# Altium project SAM_E54_Xplained_Pro.PrjPCB (part 4 of 4)
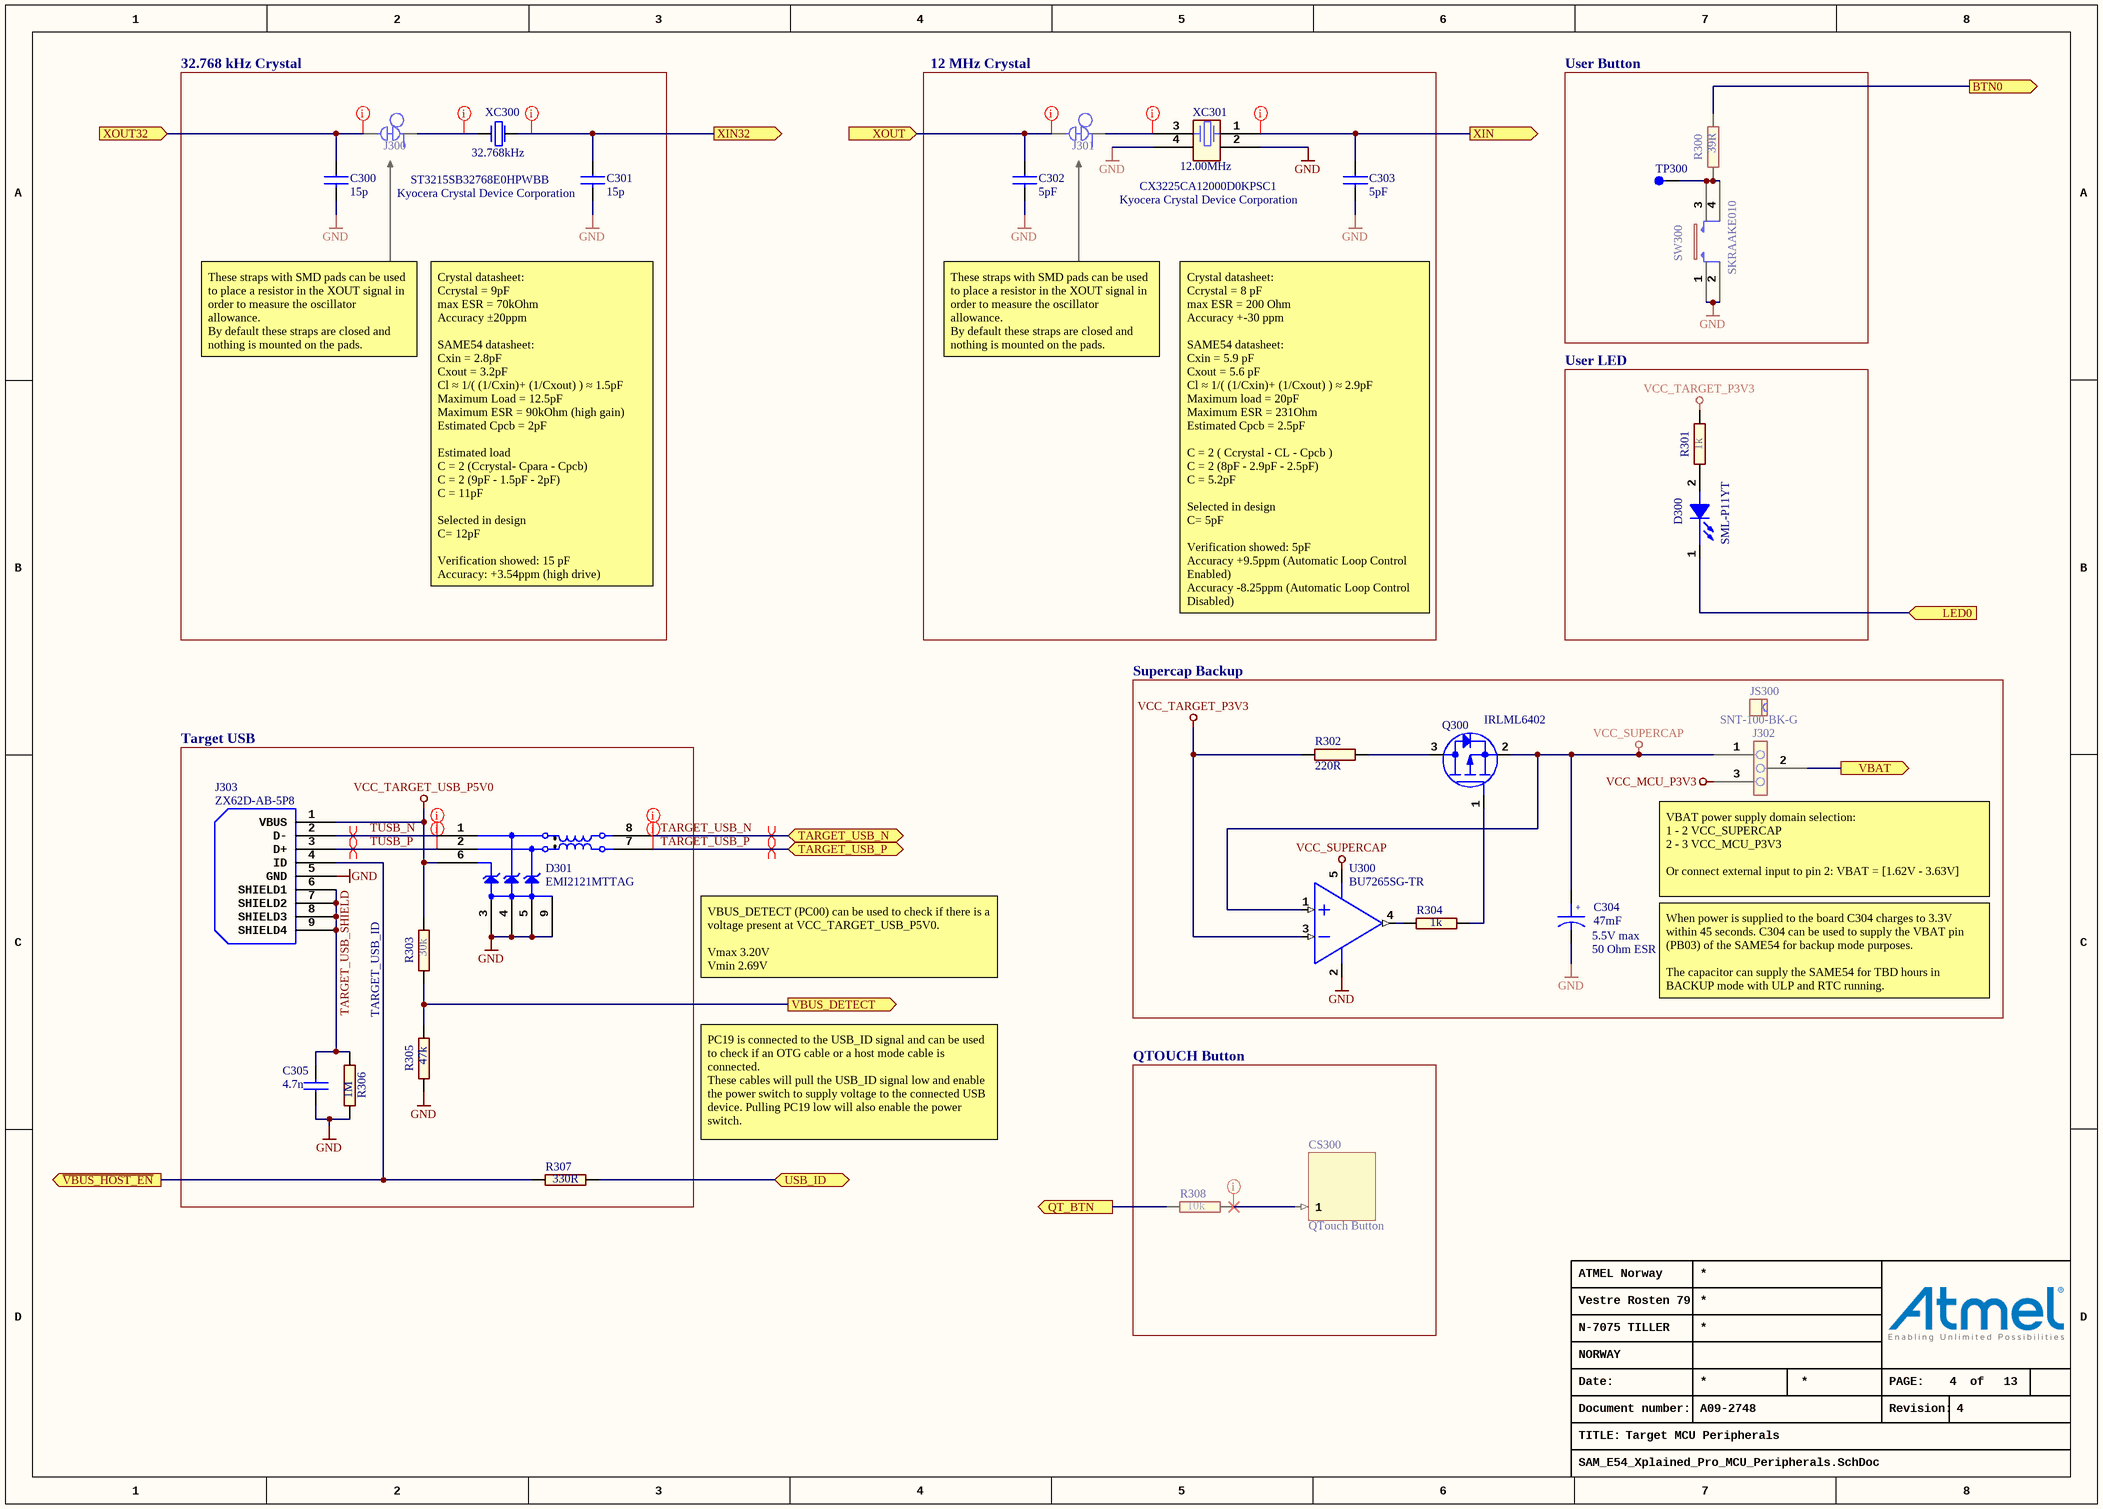
[diagram p13: SAM_E54_Xplained_Pro_MCU_Peripherals.SchDoc]

## Nets that join several sheets
GND: SAM_E54_Xplained_Pro_Target_MCU (33 pins), SAM_E54_Xplained_Pro_EDBG (36 pins), SAM_E54_Xplained_Pro_Connectors (19 pins), SAM_E54_Xplained_Pro_triple_input_power_supply_HSW (21 pins), SAM_E54_Xplained_Pro_current_measurement (Q901.2 R900.1 R901.1), SAM_E54_Xplained_Pro_current_measurement_calibration (R1003.1 R1004.1 R1005.1 R1006.1), SAM_E54_Xplained_Pro_current_measurement_control (12 pins), SAM_E54_Xplained_Pro_current_measurement_frontend (12 pins), SAM_E54_Xplained_Pro_Ethernet (20 pins), SAM_E54_Xplained_Pro_CAN (6 pins), SAM_E54_Xplained_Pro_Memory (20 pins), SAM_E54_Xplained_Pro_MCU_Peripherals (18 pins)
VCC_CM_P3V3: SAM_E54_Xplained_Pro_triple_input_power_supply_HSW (R101.1), SAM_E54_Xplained_Pro_current_measurement (R902.2), SAM_E54_Xplained_Pro_current_measurement_calibration (R1000.2 R1001.2 R1002.2), SAM_E54_Xplained_Pro_current_measurement_control (6 pins), SAM_E54_Xplained_Pro_current_measurement_frontend (L1200.1)
VCC_EDBG_P3V3: SAM_E54_Xplained_Pro_EDBG (23 pins), SAM_E54_Xplained_Pro_triple_input_power_supply_HSW (R103.1)
VCC_EDBG_USB_P5V0: SAM_E54_Xplained_Pro_EDBG (C803.1 L800.2 U800.A10), SAM_E54_Xplained_Pro_triple_input_power_supply_HSW (Q101.1 R106.2)
VCC_EXT_P5V0: SAM_E54_Xplained_Pro_Connectors (J400.1), SAM_E54_Xplained_Pro_triple_input_power_supply_HSW (5 pins)
VCC_MCU_P3V3: SAM_E54_Xplained_Pro_Target_MCU (19 pins), SAM_E54_Xplained_Pro_triple_input_power_supply_HSW (J103.1), SAM_E54_Xplained_Pro_MCU_Peripherals (J302.3)
VCC_P5V0: SAM_E54_Xplained_Pro_Connectors (J400.3), SAM_E54_Xplained_Pro_triple_input_power_supply_HSW (12 pins), SAM_E54_Xplained_Pro_current_measurement_control (R1104.2), SAM_E54_Xplained_Pro_current_measurement_frontend (L1201.1), SAM_E54_Xplained_Pro_CAN (C501.1 C502.1 U500.3)
VCC_TARGET_P3V3: SAM_E54_Xplained_Pro_Target_MCU (9 pins), SAM_E54_Xplained_Pro_Connectors (7 pins), SAM_E54_Xplained_Pro_triple_input_power_supply_HSW (J100.2 R110.2), SAM_E54_Xplained_Pro_Ethernet (12 pins), SAM_E54_Xplained_Pro_CAN (C503.1 U500.5), SAM_E54_Xplained_Pro_Memory (19 pins), SAM_E54_Xplained_Pro_MCU_Peripherals (R301.2 R302.1 U300.3)
VCC_TARGET_USB_P5V0: SAM_E54_Xplained_Pro_triple_input_power_supply_HSW (Q102.1 Q103.1 R107.2), SAM_E54_Xplained_Pro_MCU_Peripherals (D301.6 J303.1 R303.2)
CM_PA00_GPIO: SAM_E54_Xplained_Pro_current_measurement_calibration (Q1001.1 R1001.1), SAM_E54_Xplained_Pro_current_measurement_control (U1100.1)
CM_PA01_GPIO: SAM_E54_Xplained_Pro_current_measurement_calibration (Q1000.1 R1002.1), SAM_E54_Xplained_Pro_current_measurement_control (U1100.2)
CM_PA05_AIN5: SAM_E54_Xplained_Pro_current_measurement_control (U1100.5 U1100.6), SAM_E54_Xplained_Pro_current_measurement_frontend (C1206.2 R1208.2 U1200.7)
CM_PA08_AIN16: SAM_E54_Xplained_Pro_current_measurement_control (U1100.11), SAM_E54_Xplained_Pro_current_measurement_frontend (C1202.2 R1203.2 U1200.1)
CM_PA09_AIN17: SAM_E54_Xplained_Pro_EDBG (U800.K10), SAM_E54_Xplained_Pro_triple_input_power_supply_HSW (R111.1 R112.2), SAM_E54_Xplained_Pro_current_measurement_control (U1100.12)
CM_PA10_GPIO: SAM_E54_Xplained_Pro_current_measurement (Q900.1 Q901.1 R901.2), SAM_E54_Xplained_Pro_current_measurement_control (U1100.13)
CM_PA11_GCLK5: SAM_E54_Xplained_Pro_EDBG (U800.J3), SAM_E54_Xplained_Pro_current_measurement_control (U1100.14)
CM_PA14_GCLK0: SAM_E54_Xplained_Pro_EDBG (U800.C1), SAM_E54_Xplained_Pro_current_measurement_control (U1100.15)
CM_PA15_GPIO: SAM_E54_Xplained_Pro_current_measurement_calibration (Q1002.1 R1000.1), SAM_E54_Xplained_Pro_current_measurement_control (U1100.16)
CM_PA16_SERCOM1_SDA: SAM_E54_Xplained_Pro_EDBG (U800.J7), SAM_E54_Xplained_Pro_current_measurement_control (R1102.1 U1100.17)
CM_PA17_SERCOM1_SCL: SAM_E54_Xplained_Pro_EDBG (U800.K7), SAM_E54_Xplained_Pro_current_measurement_control (R1103.1 U1100.18)
CM_PA18_CMP0: SAM_E54_Xplained_Pro_current_measurement_control (U1100.19), SAM_E54_Xplained_Pro_current_measurement_frontend (Q1200.1 R1201.2)
CM_PA22_SERCOM3_PAD0_SPI_MOSI: SAM_E54_Xplained_Pro_EDBG (U800.C2), SAM_E54_Xplained_Pro_current_measurement_control (U1100.21)
CM_PA23_SERCOM3_PAD1_SPI_SCK: SAM_E54_Xplained_Pro_EDBG (U800.C4), SAM_E54_Xplained_Pro_current_measurement_control (U1100.22)
CM_PA24_SERCOM3_PAD2_SPI_MISO: SAM_E54_Xplained_Pro_EDBG (U800.B1), SAM_E54_Xplained_Pro_current_measurement_control (U1100.23)
CM_PA25_SPI_SS: SAM_E54_Xplained_Pro_EDBG (U800.D1), SAM_E54_Xplained_Pro_current_measurement_control (U1100.24)
CM_PA30_SWCLK: SAM_E54_Xplained_Pro_EDBG (U800.F4), SAM_E54_Xplained_Pro_current_measurement_control (U1100.31)
CM_PA31_SWDIO: SAM_E54_Xplained_Pro_EDBG (U800.E3), SAM_E54_Xplained_Pro_current_measurement_control (U1100.32)
CM_RESET_N: SAM_E54_Xplained_Pro_EDBG (U800.F3), SAM_E54_Xplained_Pro_current_measurement_control (U1100.26)
ID1: SAM_E54_Xplained_Pro_EDBG (R800.1 U800.A1), SAM_E54_Xplained_Pro_Connectors (J401.1)
ID2: SAM_E54_Xplained_Pro_EDBG (R801.1 U800.B2), SAM_E54_Xplained_Pro_Connectors (J402.1)
ID3: SAM_E54_Xplained_Pro_EDBG (R823.1 U800.B3), SAM_E54_Xplained_Pro_Connectors (J403.1)
NetJ100_3: SAM_E54_Xplained_Pro_triple_input_power_supply_HSW (J100.3 J102.3), SAM_E54_Xplained_Pro_current_measurement (Q900.3)
NetJ303_4: SAM_E54_Xplained_Pro_triple_input_power_supply_HSW (Q104.5 R110.1), SAM_E54_Xplained_Pro_MCU_Peripherals (J303.4 R307.1)
NetJ406_9: SAM_E54_Xplained_Pro_Target_MCU (R208.2), SAM_E54_Xplained_Pro_Connectors (J406.9)
NetJ406_10: SAM_E54_Xplained_Pro_Target_MCU (R207.2), SAM_E54_Xplained_Pro_Connectors (J406.10)
NetJ406_11: SAM_E54_Xplained_Pro_Target_MCU (R206.2), SAM_E54_Xplained_Pro_Connectors (J406.11)
NetJ406_12: SAM_E54_Xplained_Pro_Target_MCU (R205.2), SAM_E54_Xplained_Pro_Connectors (J406.12)
NetQ900_2: SAM_E54_Xplained_Pro_current_measurement (Q900.2 Q902.2 R900.2), SAM_E54_Xplained_Pro_current_measurement_frontend (Q1200.3 R1202.2 U1201.2)
NetQ902_3: SAM_E54_Xplained_Pro_current_measurement (Q902.3), SAM_E54_Xplained_Pro_current_measurement_calibration (Q1000.2 Q1001.2 Q1002.2 R1006.2)
PA00_XIN32: SAM_E54_Xplained_Pro_Target_MCU (U200.1), SAM_E54_Xplained_Pro_MCU_Peripherals (C301.1 XC300.1)
PA01_XOUT32: SAM_E54_Xplained_Pro_Target_MCU (U200.2), SAM_E54_Xplained_Pro_MCU_Peripherals (C300.1 J300.2)
PA02_ADC0_AIN0_DAC0: SAM_E54_Xplained_Pro_Target_MCU (U200.9), SAM_E54_Xplained_Pro_Connectors (J408.1)
PA03_ADC0_AIN1: SAM_E54_Xplained_Pro_Target_MCU (U200.10), SAM_E54_Xplained_Pro_Connectors (J402.4)
PA04_S0P0_UART_TX: SAM_E54_Xplained_Pro_Target_MCU (U200.21), SAM_E54_Xplained_Pro_Connectors (J401.14)
PA05_S0P1_UART_RX: SAM_E54_Xplained_Pro_Target_MCU (U200.22), SAM_E54_Xplained_Pro_Connectors (J401.13)
PA06_GPIO_S0P2_RTS: SAM_E54_Xplained_Pro_Target_MCU (U200.23), SAM_E54_Xplained_Pro_Connectors (J401.5)
PA07_GPIO_S0P3_CTS: SAM_E54_Xplained_Pro_Target_MCU (U200.24), SAM_E54_Xplained_Pro_Connectors (J401.6)
PA08_QSPI_DATA0: SAM_E54_Xplained_Pro_Target_MCU (U200.33), SAM_E54_Xplained_Pro_Memory (R713.2)
PA09_QSPI_DATA1: SAM_E54_Xplained_Pro_Target_MCU (U200.34), SAM_E54_Xplained_Pro_Memory (R714.2)
PA10_QSPI_DATA2: SAM_E54_Xplained_Pro_Target_MCU (U200.35), SAM_E54_Xplained_Pro_Memory (R715.2)
PA11_QSPI_DATA3: SAM_E54_Xplained_Pro_Target_MCU (U200.36), SAM_E54_Xplained_Pro_Memory (R716.2)
PA12_ETH_GRX1: SAM_E54_Xplained_Pro_Target_MCU (U200.60), SAM_E54_Xplained_Pro_Connectors (J406.5), SAM_E54_Xplained_Pro_Ethernet (R625.2)
PA13_ETH_GRX0: SAM_E54_Xplained_Pro_Target_MCU (U200.61), SAM_E54_Xplained_Pro_Connectors (J406.6), SAM_E54_Xplained_Pro_Ethernet (R624.2)
PA14_ETH_GTXCK: SAM_E54_Xplained_Pro_Target_MCU (U200.62), SAM_E54_Xplained_Pro_Connectors (J406.7), SAM_E54_Xplained_Pro_Ethernet (R630.2)
PA15_ETH_GRXER: SAM_E54_Xplained_Pro_Target_MCU (U200.63), SAM_E54_Xplained_Pro_Connectors (J406.8), SAM_E54_Xplained_Pro_Ethernet (R626.2)
PA16_PCC_D00_PTCXY10: SAM_E54_Xplained_Pro_Target_MCU (U200.66), SAM_E54_Xplained_Pro_Connectors (J406.16), SAM_E54_Xplained_Pro_MCU_Peripherals (R308.2)
PA17_ETH_GTXEN: SAM_E54_Xplained_Pro_Target_MCU (U200.67), SAM_E54_Xplained_Pro_Connectors (J406.15), SAM_E54_Xplained_Pro_Ethernet (R621.2)
PA18_ETH_GTX0: SAM_E54_Xplained_Pro_Target_MCU (U200.68), SAM_E54_Xplained_Pro_Connectors (J406.14), SAM_E54_Xplained_Pro_Ethernet (R622.2)
PA19_ETH_GTX1: SAM_E54_Xplained_Pro_Target_MCU (U200.69), SAM_E54_Xplained_Pro_Connectors (J406.13), SAM_E54_Xplained_Pro_Ethernet (R623.2)
PA20_SDHC_CMD: SAM_E54_Xplained_Pro_Target_MCU (R205.1 U200.88), SAM_E54_Xplained_Pro_Memory (J700.2 R705.1)
PA21_SDHC_CK: SAM_E54_Xplained_Pro_Target_MCU (R206.1 U200.89), SAM_E54_Xplained_Pro_Memory (J700.5)
PA22_S3P0_I2C_SDA: SAM_E54_Xplained_Pro_Target_MCU (R207.1 R220.1 U200.92), SAM_E54_Xplained_Pro_Connectors (J401.11)
PA23_S3P1_I2C_SCL: SAM_E54_Xplained_Pro_Target_MCU (R208.1 R221.1 U200.93), SAM_E54_Xplained_Pro_Connectors (J401.12)
PA27_GPIO_SPI_SS_B: SAM_E54_Xplained_Pro_Target_MCU (U200.113), SAM_E54_Xplained_Pro_Connectors (J401.10)
PA30_SWCLK: SAM_E54_Xplained_Pro_Target_MCU (R222.1 U200.119), SAM_E54_Xplained_Pro_EDBG (R803.1), SAM_E54_Xplained_Pro_Connectors (J404.4 J405.4)
PA31_SWDIO: SAM_E54_Xplained_Pro_Target_MCU (U200.120), SAM_E54_Xplained_Pro_EDBG (R824.1), SAM_E54_Xplained_Pro_Connectors (J404.2 J405.2)
PB00_ADC0_AIN12: SAM_E54_Xplained_Pro_Target_MCU (U200.125), SAM_E54_Xplained_Pro_Connectors (J402.3)
PB01_GPIO: SAM_E54_Xplained_Pro_Target_MCU (U200.126), SAM_E54_Xplained_Pro_Connectors (J402.5)
PB02_GPIO_SPI_SS_B: SAM_E54_Xplained_Pro_Target_MCU (U200.127), SAM_E54_Xplained_Pro_Connectors (J402.10)
PB03_SUPER_CAP: SAM_E54_Xplained_Pro_Target_MCU (U200.128), SAM_E54_Xplained_Pro_MCU_Peripherals (J302.2)
PB04_ADC1_AIN6: SAM_E54_Xplained_Pro_Target_MCU (U200.11), SAM_E54_Xplained_Pro_Connectors (J401.3)
PB05_ADC1_AIN7: SAM_E54_Xplained_Pro_Target_MCU (U200.12), SAM_E54_Xplained_Pro_Connectors (J401.4)
PB06_GPIO: SAM_E54_Xplained_Pro_Target_MCU (U200.17), SAM_E54_Xplained_Pro_Connectors (J402.6)
PB07_GPIO_EXTINT7: SAM_E54_Xplained_Pro_Target_MCU (U200.18), SAM_E54_Xplained_Pro_Connectors (J401.9)
PB08_TC4_WO0: SAM_E54_Xplained_Pro_Target_MCU (U200.19), SAM_E54_Xplained_Pro_Connectors (J401.7)
PB09_TC4_WO1: SAM_E54_Xplained_Pro_Target_MCU (U200.20), SAM_E54_Xplained_Pro_Connectors (J401.8)
PB10_QSPI_SCK: SAM_E54_Xplained_Pro_Target_MCU (U200.39), SAM_E54_Xplained_Pro_Memory (R717.2)
PB11_QSPI_CS: SAM_E54_Xplained_Pro_Target_MCU (U200.40), SAM_E54_Xplained_Pro_Memory (R718.2)
PB12_CAN1_TX: SAM_E54_Xplained_Pro_Target_MCU (U200.41), SAM_E54_Xplained_Pro_CAN (U500.1)
PB13_CAN1_RX: SAM_E54_Xplained_Pro_Target_MCU (U200.42), SAM_E54_Xplained_Pro_CAN (U500.4)
PB14_TCC4_WO0: SAM_E54_Xplained_Pro_Target_MCU (U200.43), SAM_E54_Xplained_Pro_Connectors (J402.7 J406.18)
PB15_TCC4_WO1: SAM_E54_Xplained_Pro_Target_MCU (U200.44), SAM_E54_Xplained_Pro_Connectors (J402.8 J406.17)
PB16_S5P0_UART_TX: SAM_E54_Xplained_Pro_Target_MCU (U200.82), SAM_E54_Xplained_Pro_Connectors (J402.14)
PB17_S5P1_UART_RX: SAM_E54_Xplained_Pro_Target_MCU (U200.83), SAM_E54_Xplained_Pro_Connectors (J402.13)
PB18_SDHC_DATA0: SAM_E54_Xplained_Pro_Target_MCU (U200.84), SAM_E54_Xplained_Pro_Memory (J700.7 R709.1)
PB19_SDHC_DATA1: SAM_E54_Xplained_Pro_Target_MCU (U200.85), SAM_E54_Xplained_Pro_Memory (J700.8 R708.1)
PB20_SDHC_DATA2: SAM_E54_Xplained_Pro_Target_MCU (U200.86), SAM_E54_Xplained_Pro_Memory (J700.9 R707.1)
PB21_SDHC_DATA3: SAM_E54_Xplained_Pro_Target_MCU (U200.87), SAM_E54_Xplained_Pro_Memory (J700.1 R706.1)
PB22_XIN1: SAM_E54_Xplained_Pro_Target_MCU (U200.98), SAM_E54_Xplained_Pro_MCU_Peripherals (C303.1 XC301.1)
PB23_XOUT1: SAM_E54_Xplained_Pro_Target_MCU (U200.99), SAM_E54_Xplained_Pro_MCU_Peripherals (C302.1 J301.2)
PB24_S2P1_UART_RX: SAM_E54_Xplained_Pro_Target_MCU (U200.100), SAM_E54_Xplained_Pro_EDBG (R809.1)
PB25_S2P0_UART_TX: SAM_E54_Xplained_Pro_Target_MCU (U200.101), SAM_E54_Xplained_Pro_EDBG (R808.2)
PB26_S4P1_SPI_SCK: SAM_E54_Xplained_Pro_Target_MCU (U200.102), SAM_E54_Xplained_Pro_Connectors (J401.18)
PB27_S4P0_SPI_MOSI: SAM_E54_Xplained_Pro_Target_MCU (U200.103), SAM_E54_Xplained_Pro_Connectors (J401.16)
PB28_S4P2_SPI_SS: SAM_E54_Xplained_Pro_Target_MCU (U200.104), SAM_E54_Xplained_Pro_Connectors (J401.15)
PB29_S4P3_SPI_MISO: SAM_E54_Xplained_Pro_Target_MCU (U200.105), SAM_E54_Xplained_Pro_Connectors (J401.17)
PB30_SWO: SAM_E54_Xplained_Pro_Target_MCU (U200.121), SAM_E54_Xplained_Pro_EDBG (R827.1), SAM_E54_Xplained_Pro_Connectors (J404.6 J405.6)
PB31_USER_BTN_DGI3: SAM_E54_Xplained_Pro_Target_MCU (U200.122), SAM_E54_Xplained_Pro_EDBG (R826.1), SAM_E54_Xplained_Pro_MCU_Peripherals (R300.2)
PC00_USB_VBUS: SAM_E54_Xplained_Pro_Target_MCU (U200.3), SAM_E54_Xplained_Pro_MCU_Peripherals (R303.1 R305.2)
PC01_GPIO: SAM_E54_Xplained_Pro_Target_MCU (U200.4), SAM_E54_Xplained_Pro_Connectors (J403.5)
PC02_ADC1_AIN4: SAM_E54_Xplained_Pro_Target_MCU (U200.7), SAM_E54_Xplained_Pro_Connectors (J403.3)
PC03_ADC1_AIN5: SAM_E54_Xplained_Pro_Target_MCU (U200.8), SAM_E54_Xplained_Pro_Connectors (J403.4)
PC04_S6P0_SPI_MOSI: SAM_E54_Xplained_Pro_Target_MCU (U200.27), SAM_E54_Xplained_Pro_EDBG (R816.1), SAM_E54_Xplained_Pro_Connectors (J402.16 J403.16)
PC05_S6P1_SPI_SCK: SAM_E54_Xplained_Pro_Target_MCU (U200.28), SAM_E54_Xplained_Pro_EDBG (R817.1), SAM_E54_Xplained_Pro_Connectors (J402.18 J403.18)
PC06_S6P2_SPI_SS: SAM_E54_Xplained_Pro_Target_MCU (U200.29), SAM_E54_Xplained_Pro_Connectors (J402.15)
PC07_S6P3_SPI_MISO: SAM_E54_Xplained_Pro_Target_MCU (U200.30), SAM_E54_Xplained_Pro_EDBG (R815.2), SAM_E54_Xplained_Pro_Connectors (J402.17 J403.17)
PC10_GPIO: SAM_E54_Xplained_Pro_Target_MCU (U200.52), SAM_E54_Xplained_Pro_Connectors (J403.6)
PC11_ETH_GMDC: SAM_E54_Xplained_Pro_Target_MCU (U200.55), SAM_E54_Xplained_Pro_Connectors (J406.20), SAM_E54_Xplained_Pro_Ethernet (R629.2)
PC12_ETH_GMDIO: SAM_E54_Xplained_Pro_Target_MCU (U200.56), SAM_E54_Xplained_Pro_Connectors (J406.19), SAM_E54_Xplained_Pro_Ethernet (R628.2)
PC13_CAN_STBY: SAM_E54_Xplained_Pro_Target_MCU (U200.57), SAM_E54_Xplained_Pro_CAN (U500.8)
PC14_EXT3_SPI_SS: SAM_E54_Xplained_Pro_Target_MCU (U200.58), SAM_E54_Xplained_Pro_Connectors (J403.15)
PC15_ETH_LED: SAM_E54_Xplained_Pro_Target_MCU (U200.59), SAM_E54_Xplained_Pro_Ethernet (J600.12)
PC16_PDEC0_DGI0: SAM_E54_Xplained_Pro_Target_MCU (R202.1 U200.70), SAM_E54_Xplained_Pro_EDBG (R810.1), SAM_E54_Xplained_Pro_Connectors (J407.1)
PC17_PDEC1_DGI1: SAM_E54_Xplained_Pro_Target_MCU (R203.2 U200.71), SAM_E54_Xplained_Pro_EDBG (R811.1), SAM_E54_Xplained_Pro_Connectors (J407.2)
PC18_PDEC2_DGI2_LED: SAM_E54_Xplained_Pro_Target_MCU (R209.2 U200.72), SAM_E54_Xplained_Pro_EDBG (R825.1), SAM_E54_Xplained_Pro_Connectors (J407.3), SAM_E54_Xplained_Pro_MCU_Peripherals (D300.1)
PC19_USB_ID: SAM_E54_Xplained_Pro_Target_MCU (U200.73), SAM_E54_Xplained_Pro_MCU_Peripherals (R307.2)
PC20_ETH_GRXDV: SAM_E54_Xplained_Pro_Target_MCU (U200.74), SAM_E54_Xplained_Pro_Ethernet (R609.1 R616.2 U600.15)
PC21_ETH_RESET: SAM_E54_Xplained_Pro_Target_MCU (U200.75), SAM_E54_Xplained_Pro_Ethernet (C613.1 R602.1 U600.24)
PC22_S1P0_UART_TX: SAM_E54_Xplained_Pro_Target_MCU (U200.76), SAM_E54_Xplained_Pro_Connectors (J403.14)
PC23_S1P1_UART_RX: SAM_E54_Xplained_Pro_Target_MCU (U200.77), SAM_E54_Xplained_Pro_Connectors (J403.13)
PC24_TRACE_DATA3: SAM_E54_Xplained_Pro_Target_MCU (U200.108), SAM_E54_Xplained_Pro_Connectors (J405.20)
PC25_TRACE_DATA2: SAM_E54_Xplained_Pro_Target_MCU (U200.109), SAM_E54_Xplained_Pro_Connectors (J405.18)
PC26_TRACE_DATA1: SAM_E54_Xplained_Pro_Target_MCU (U200.110), SAM_E54_Xplained_Pro_Connectors (J405.16)
PC27_TRACE_CLK: SAM_E54_Xplained_Pro_Target_MCU (U200.111), SAM_E54_Xplained_Pro_Connectors (J405.12)
PC28_TRACE_DATA0: SAM_E54_Xplained_Pro_Target_MCU (U200.112), SAM_E54_Xplained_Pro_Connectors (J405.14)
PC30_GPIO_EXTINT14: SAM_E54_Xplained_Pro_Target_MCU (U200.123), SAM_E54_Xplained_Pro_Connectors (J403.9)
PC31_GPIO_SPI_SS_B: SAM_E54_Xplained_Pro_Target_MCU (U200.124), SAM_E54_Xplained_Pro_Connectors (J403.10)
PD00_GPIO_EXTINT0: SAM_E54_Xplained_Pro_Target_MCU (U200.13), SAM_E54_Xplained_Pro_Connectors (J402.9)
PD01_EDBG_SPI_SS: SAM_E54_Xplained_Pro_Target_MCU (U200.16), SAM_E54_Xplained_Pro_EDBG (R818.1)
PD08_S7P0_I2C_SDA: SAM_E54_Xplained_Pro_Target_MCU (R223.1 U200.47), SAM_E54_Xplained_Pro_EDBG (R813.2), SAM_E54_Xplained_Pro_Connectors (J402.11 J403.11 J406.4), SAM_E54_Xplained_Pro_Memory (U700.5 U701.5)
PD09_S7P1_I2C_SCL: SAM_E54_Xplained_Pro_Target_MCU (R224.1 U200.48), SAM_E54_Xplained_Pro_EDBG (R814.2), SAM_E54_Xplained_Pro_Connectors (J402.12 J403.12 J406.3), SAM_E54_Xplained_Pro_Memory (U700.6 U701.6)
PD10_TCC0_WO3: SAM_E54_Xplained_Pro_Target_MCU (U200.49), SAM_E54_Xplained_Pro_Connectors (J403.7)
PD11_TCC0_WO4: SAM_E54_Xplained_Pro_Target_MCU (U200.50), SAM_E54_Xplained_Pro_Connectors (J403.8)
PD12_ETH_IRQ: SAM_E54_Xplained_Pro_Target_MCU (U200.51), SAM_E54_Xplained_Pro_Ethernet (R615.1 U600.18)
PD20_SDHC_CD: SAM_E54_Xplained_Pro_Target_MCU (U200.80), SAM_E54_Xplained_Pro_Memory (J700.10 R710.1)
PD21_SDHC_WP: SAM_E54_Xplained_Pro_Target_MCU (U200.81), SAM_E54_Xplained_Pro_Memory (J700.12 R711.1)
TARGET_RESETN: SAM_E54_Xplained_Pro_Target_MCU (C200.1 R200.1 R201.2 U200.114), SAM_E54_Xplained_Pro_EDBG (R802.2 R812.1), SAM_E54_Xplained_Pro_Connectors (J404.10 J405.10)
TARGET_USB_N: SAM_E54_Xplained_Pro_Target_MCU (U200.94), SAM_E54_Xplained_Pro_MCU_Peripherals (D301.8)
TARGET_USB_P: SAM_E54_Xplained_Pro_Target_MCU (U200.95), SAM_E54_Xplained_Pro_MCU_Peripherals (D301.7)
VCC_CM_IN_P3V3: SAM_E54_Xplained_Pro_triple_input_power_supply_HSW (J100.1 J101.1 J102.1 R111.2), SAM_E54_Xplained_Pro_current_measurement_frontend (R1200.1 R1201.1 R1202.1 R1204.2)

## Assembly variants
Default_assembly: not fitted C218 C305 C805 J406 J407 J408 J500 R205 R206 R207 R208 R306 R400 R401 R402 R403 R404 R405 R406 R407 R408 R409 R410 R411 R412 R413 R414 R415 R609 R613 R619 R822